# Altium schematic sheet sensors.SchDoc
size A
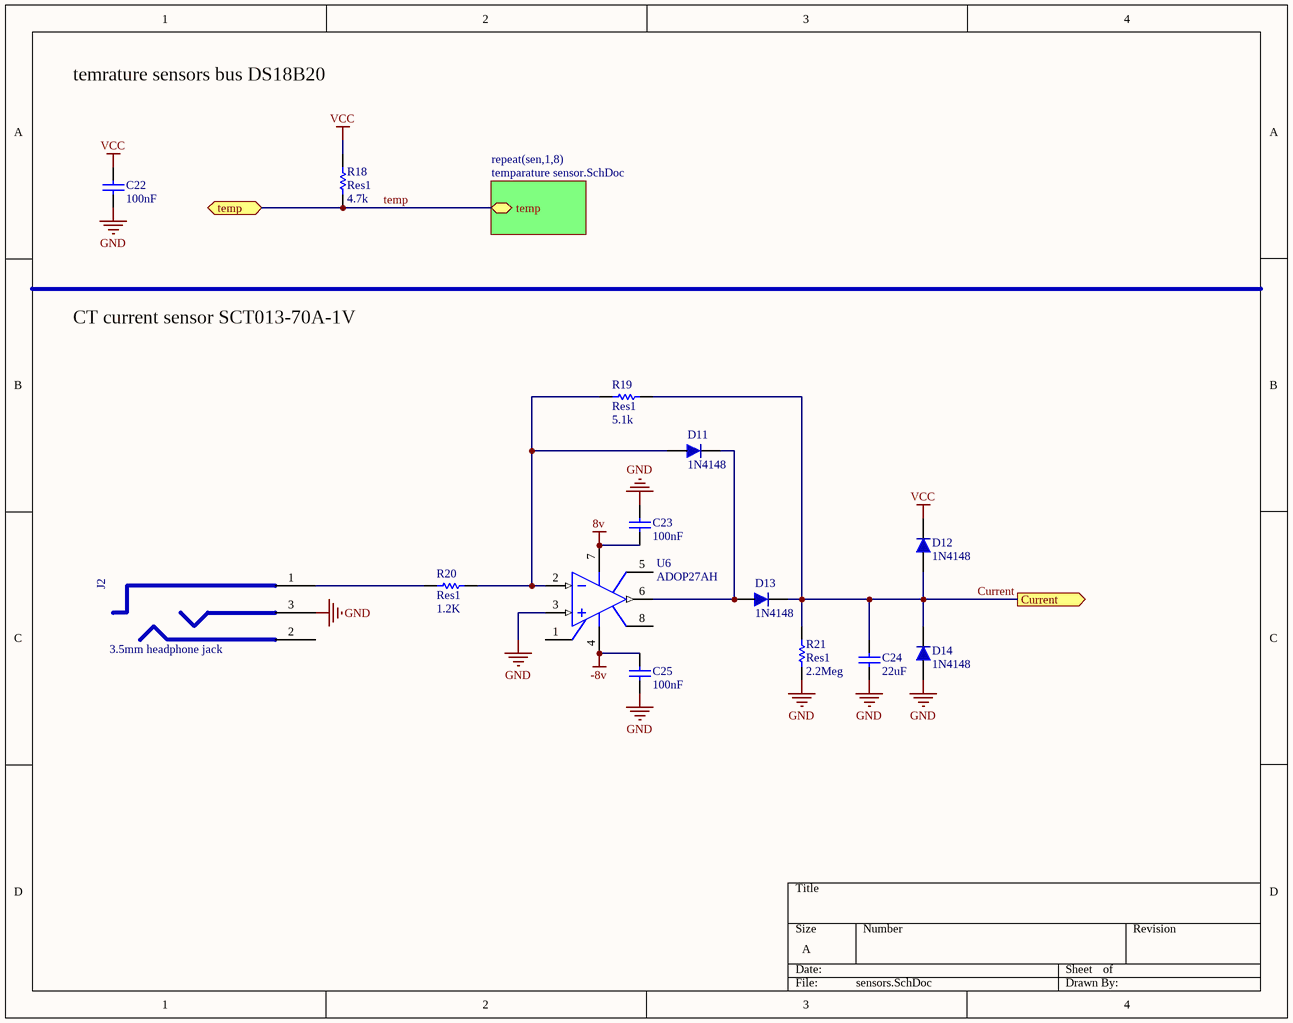
[diagram p0: sensors.SchDoc]

## Parts
C22  value 100nF  [CAP 1206 (3216X15L)]  (hidden comment: Cap)
C23  value 100nF  [CAP 1206 (3216X15L)]  (hidden comment: Cap)
C24  value 22uF  [CAP 1206 (3216X15L)]  (hidden comment: Cap)
C25  value 100nF  [CAP 1206 (3216X15L)]  (hidden comment: Cap)
D11  1N4148  [LL4148]
D12  1N4148  [LL4148]
D13  1N4148  [LL4148]
D14  1N4148  [LL4148]
J2  3.5mm headphone jack  [phone jack]
R18  Res1  value 4.7k  [RES 1206 (3216X08L)]
R19  Res1  value 5.1k  [RES 1206 (3216X08L)]
R20  Res1  value 1.2K  [RES 1206 (3216X08L)]
R21  Res1  value 2.2Meg  [RES 1206 (3216X08L)]
U6  ADOP27AH  [SOIC8-Narrow]

## Sub-sheets
repeat(sen,1,8) = temparature sensor.SchDoc: temp (bidir)

## Ports
Current (out), temp (bidir)

## Nets
8v: C23.1 U6.7(V+)
-8v: C25.2 U6.4(V-)
GND: C22.1 C23.2 C24.1 C25.1 D14.1 J2.3(Tip) R21.1 U6.3(IN+)
VCC: C22.2 D12.2 R18.2
Current: C24.2 D12.1 D13.2 D14.2 R19.2 R21.2 ; port Current
temp: R18.1 ; port temp, sheet repeat(sen,1,8)/temp
NetD11_1: D11.1 R19.1 R20.2 U6.2(IN-)
NetD11_2: D11.2 D13.1 U6.6(OUT)
NetJ2_1: J2.1(Ring) R20.1

Not connected (* = marked no-connect by the designer): J2 2(Ring); U6 1(OS_NULL) 5(NC) 8(OS_NULL)

## Notes on the sheet
- temrature sensors bus DS18B20
- CT current sensor SCT013-70A-1V

## Library data of the parts
C22-C25 = Cap ceramic: CAP-100Nf
D11-D14 = 1N4148: DIODE GEN PURP 100V 200MA DO35; Published: 2017-1-12; PackageVersion: 2017-1-12; PackageReference: DO 35; Publisher: Abbas Basereh; PackageDescription: DIODE GEN PURP 100V 200MA DO35; ComponentLink1Description: Manufacturer Link; ComponentLink1URL: http://www.digikey.com/product-detail/en/fairchild-on-semiconductor/1N4148/1N4148FS-ND/458603; ComponentLink2Description: Datasheet; PART.NO: 1N4148
J2 = phone jack
R18-R21 = Res1: Resistor; Published: 8-Jun-2000; LatestRevisionDate: 17-Jul-2002; LatestRevisionNote: Re-released for DXP Platform.; PackageReference: AXIAL-0.3; Publisher: Altium Limited; PackageDescription: Axial Device, Thru-Hole; 2 Leads; 0.3 in Pin Spacing
U6 = ADOP27AH: Ultra-Low Noise, Precision Operational Amplifier; Note: Pin 5 is not connected; Pin 4 connected to case.; Published: 8-Jun-2000; LatestRevisionDate: 17-Jul-2002; LatestRevisionNote: Re-released for DXP Platform.; DatasheetVersion: 1992; PackageVersion: 1990; PackageReference: H-08A; Publisher: Altium Limited; PackageDescription: Can; 8 Leads; Pin Circle Dia. 5.08 mm; Lead Dia. 0.53 mm (max); ComponentLink1Description: Manufacturer Link; ComponentLink1URL: http://www.analog.com/